# EAGLE design BM_v2 (EAGLE 7.6.0)

## Sheet 1 of 4: Microcontroller
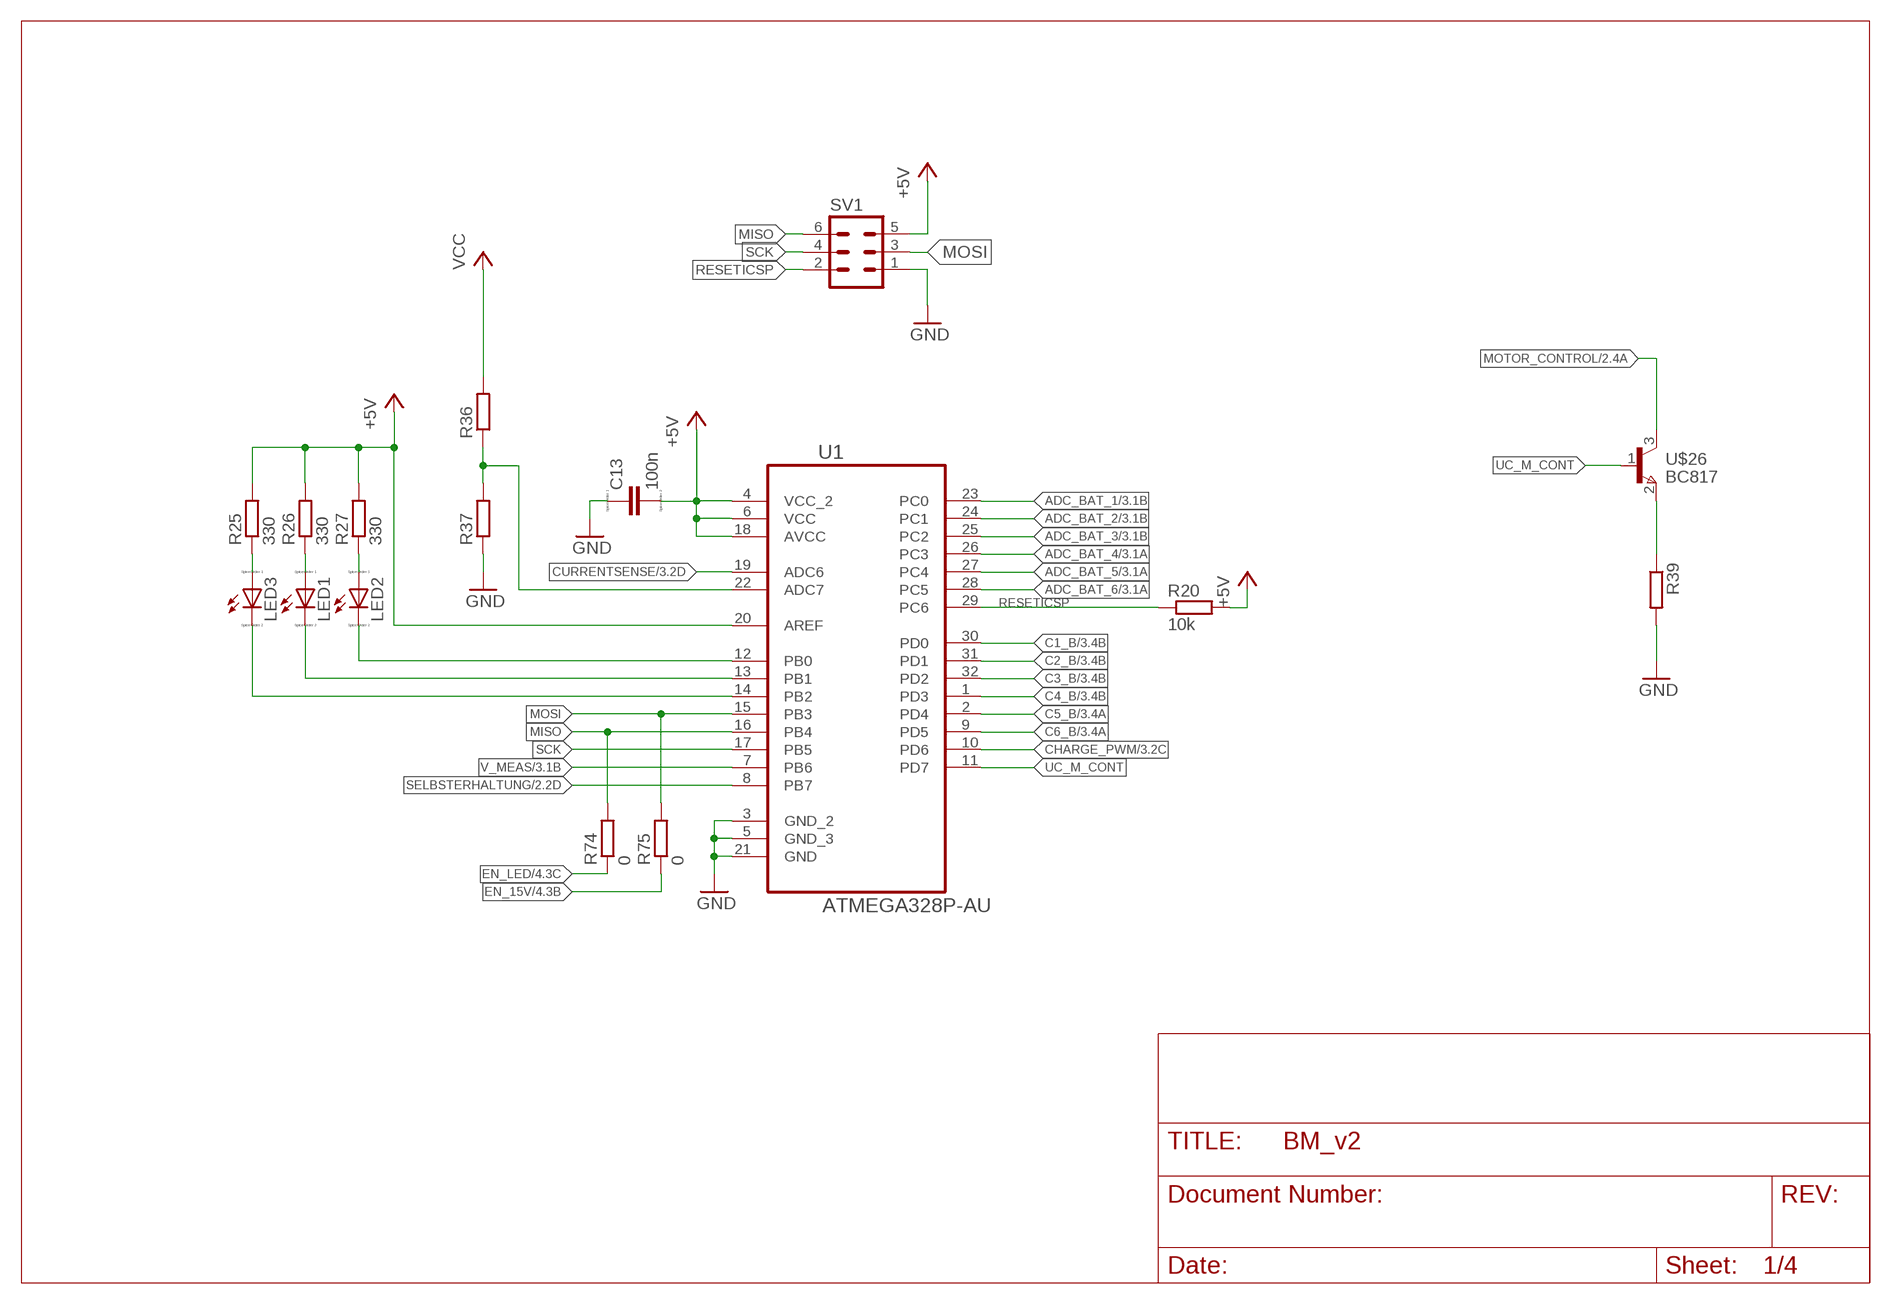
[diagram p0: schematic, sheet 1]

### Parts
C13  100n  CC0603  [C0603]
LED1  LED_E  [LED_1206]
LED2  LED_E  [LED_1206]
LED3  LED_E  [LED_1206]
R20  10k  R-EU_R0603  [R0603]
R25  330  R-EU_R0603  [R0603]
R26  330  R-EU_R0603  [R0603]
R27  330  R-EU_R0603  [R0603]
R36  R-EU_R0603  [R0603]
R37  R-EU_R0603  [R0603]
R39  R-EU_R0603  [R0603]
R74  0  R-EU_R0603  [R0603]
R75  0  R-EU_R0603  [R0603]
SV1  MA03-2  [MA03-2]
U1  ATMEGA328P-AU  [QFP80P900X900X120-32N]
U$26  BC817  [SOT23]

### Nets
+5V: C13.2 R20.2 R25.2 R26.2 R27.2 SV1.5 U1.4(VCC_2) U1.6(VCC) U1.18(AVCC) U1.20(AREF) ; also sheet 2,3
ADC_BAT_1: U1.23(PC0) ; also sheet 3
ADC_BAT_2: U1.24(PC1) ; also sheet 3
ADC_BAT_3: U1.25(PC2) ; also sheet 3
ADC_BAT_4: U1.26(PC3) ; also sheet 3
ADC_BAT_5: U1.27(PC4) ; also sheet 3
ADC_BAT_6: U1.28(PC5) ; also sheet 3
C1_B: U1.30(PD0) ; also sheet 3
C2_B: U1.31(PD1) ; also sheet 3
C3_B: U1.32(PD2) ; also sheet 3
C4_B: U1.1(PD3) ; also sheet 3
C5_B: U1.2(PD4) ; also sheet 3
C6_B: U1.9(PD5) ; also sheet 3
CHARGE_PWM: U1.10(PD6) ; also sheet 3
CURRENTSENSE: U1.19(ADC6) ; also sheet 3
EN_15V: R75.1 ; also sheet 4
EN_LED: R74.1 ; also sheet 4
GND [GND]: C13.1 R37.1 R39.2 SV1.1 U1.3(GND_2) U1.5(GND_3) U1.21(GND) ; also sheet 2,3,4
MISO: R74.2 SV1.6 U1.16(PB4)
MOSI: R75.2 SV1.3 U1.15(PB3)
MOTOR_CONTROL: U$26.3(C) ; also sheet 2
N$17: LED2.C U1.12(PB0)
N$18: LED1.C U1.13(PB1)
N$19: LED3.C U1.14(PB2)
N$23: LED2.A R27.1
N$24: LED1.A R26.1
N$25: LED3.A R25.1
N$26: R39.1 U$26.2(E)
N$27: R36.1 R37.2 U1.22(ADC7)
RESETICSP: R20.1 SV1.2 U1.29(PC6)
SCK: SV1.4 U1.17(PB5)
SELBSTERHALTUNG: U1.8(PB7) ; also sheet 2
UC_M_CONT: U1.11(PD7) U$26.1(B)
V_MEAS: U1.7(PB6) ; also sheet 3
VCC: R36.2 ; also sheet 2

## Sheet 2 of 4: Power Management
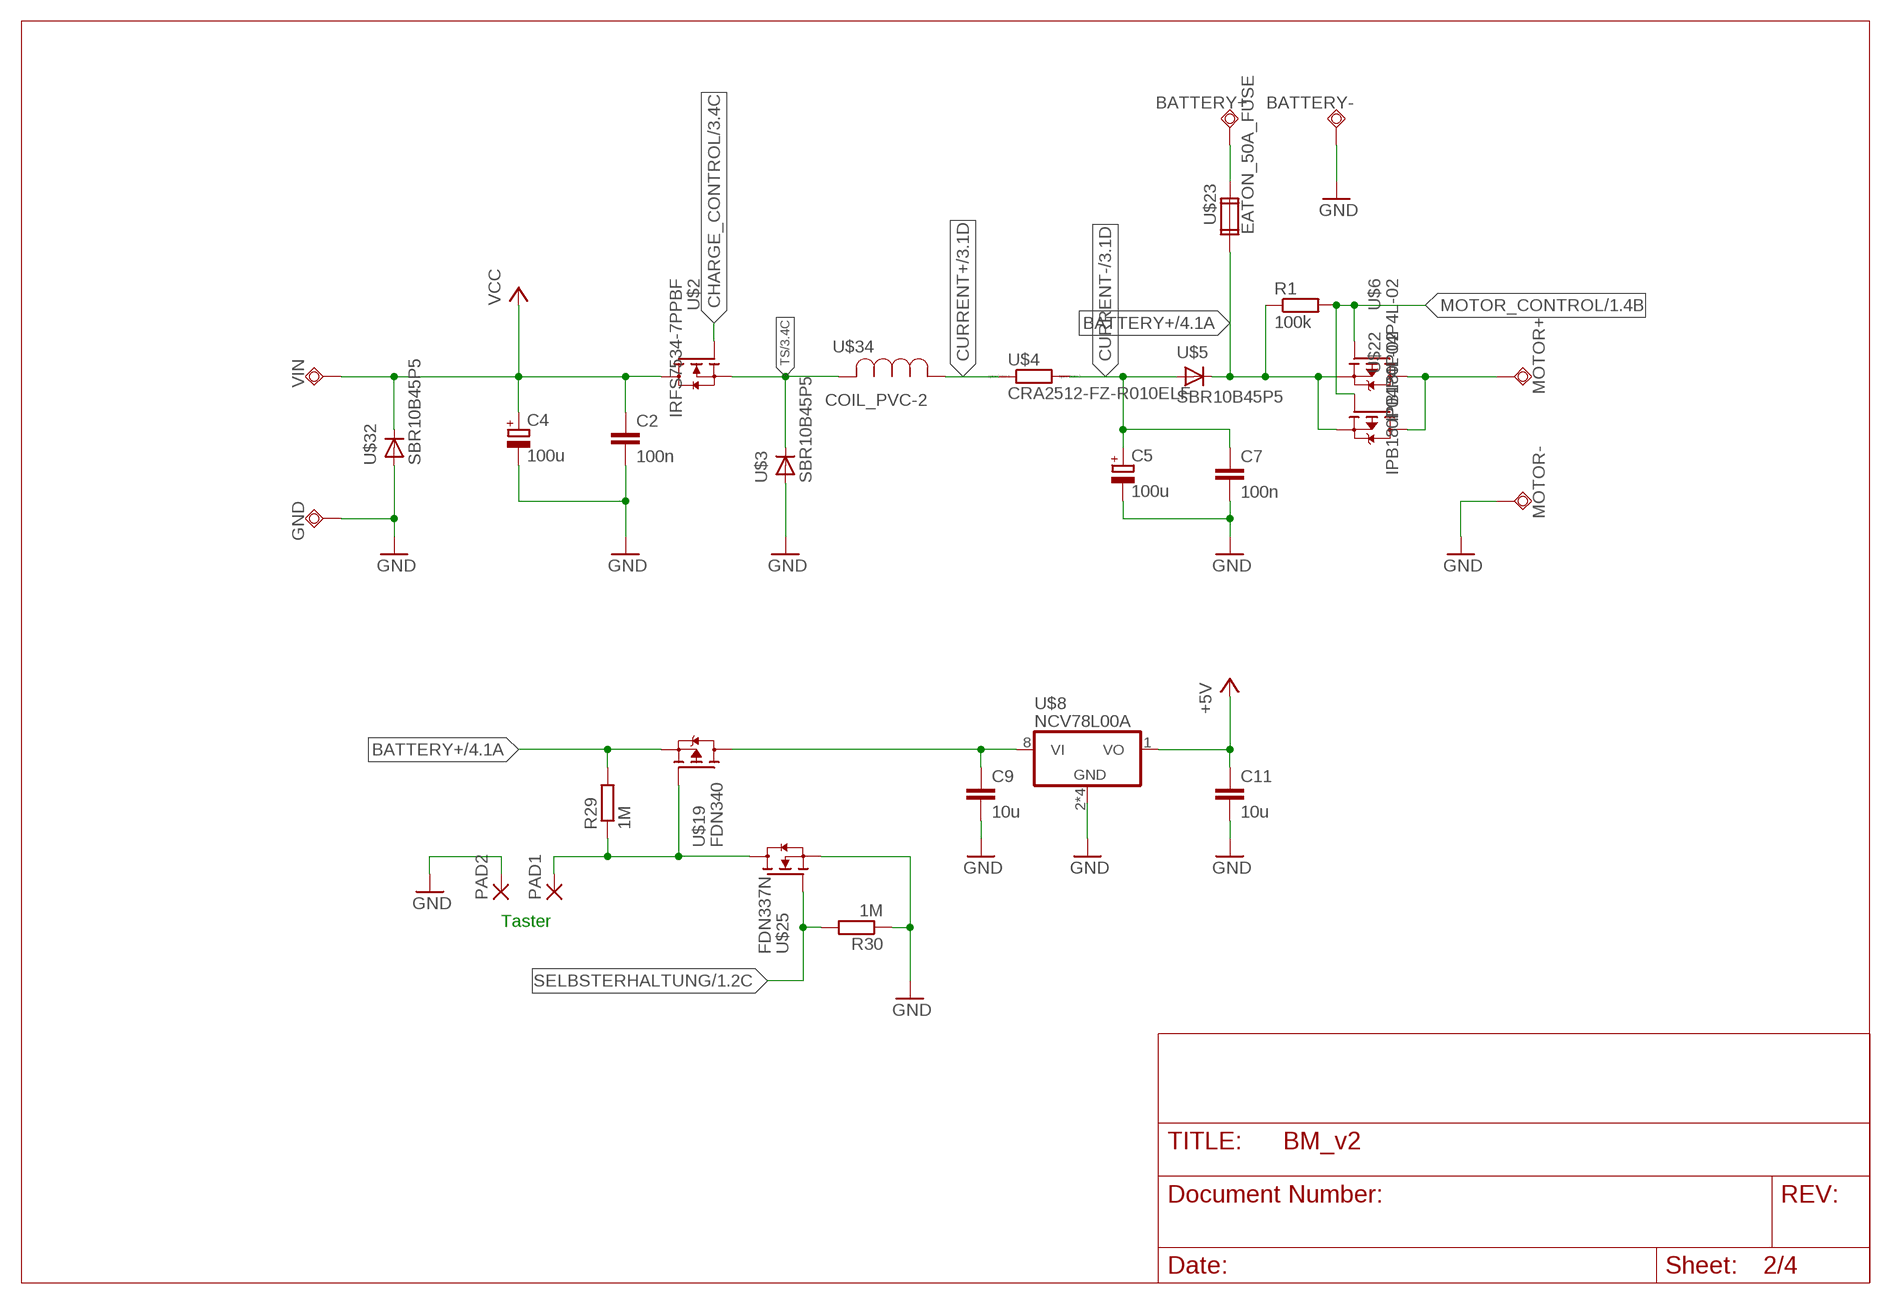
[diagram p1: schematic, sheet 2]

### Parts
BATTERY+  Battery+  PAD  [TESTPAD]
BATTERY-  Battery+  PAD  [TESTPAD]
C2  100n  C-EUC0603  [C0603]
C4  100u  CPOL-EUE3.5-10  [E3,5-10]
C5  100u  CPOL-EUE3.5-10  [E3,5-10]
C7  100n  C-EUC0603  [C0603]
C9  10u  C-EUC0805  [C0805]
C11  10u  C-EUC0805  [C0805]
GND  Battery+  PAD  [TESTPAD]
MOTOR+  Battery+  PAD  [TESTPAD]
MOTOR-  PAD  [TESTPAD]
PAD1  SMD5  [SMD2,54-5,08]
PAD2  SMD5  [SMD2,54-5,08]
R1  100k  R-EU_R0603  [R0603]
R29  1M  R-EU_R0603  [R0603]
R30  1M  R-EU_R0603  [R0603]
U$2  IRFS7534-7PPBF  [PG-TO263-7-3]
U$3  SBR10B45P5  [POWERDI-5]
U$4  CRA2512-FZ-R010ELF  [R2512]
U$5  SBR10B45P5  [POWERDI-5]
U$6  IPB180P04P4L-02  [PG-TO263-7-3]
U$8  NCV78L00A  [SOIC8]
U$19  FDN340  [SOT23]
U$22  IPB180P04P4L-02  [PG-TO263-7-3]
U$23  EATON_50A_FUSE  [LITTELFUSE]
U$25  FDN337N  [SOT23]
U$32  SBR10B45P5  [POWERDI-5]
U$34  COIL_PVC-2  [COIL_PVC-2]
VIN  Battery+  PAD  [TESTPAD]

### Nets
+5V: C11.1 U$8.1(VO) ; also sheet 1,3
BATTERY+: R1.1 R29.2 U$5.PAD(C) U$6.2(S) U$6.3(S) U$6.5(S) U$6.6(S) U$6.7(S) U$19.2(S) U$22.2(S) U$22.3(S) U$22.5(S) U$22.6(S) U$22.7(S) U$23.P$1(1A) ; also sheet 4
CHARGE_CONTROL: U$2.1(G) ; also sheet 3
CURRENT+: U$4.1 U$34.P$1 ; also sheet 3
CURRENT-: C5.+ C7.1 U$4.2 U$5.L(A) U$5.R(A) ; also sheet 3
GND [GND]: BATTERY-.P$1(TP) C2.2 C4.- C5.- C7.2 C9.2 C11.2 GND.P$1(TP) MOTOR-.P$1(TP) PAD2.1(P) R30.1 U$3.L(A) U$3.R(A) U$8.2(GND) U$8.3(GND) U$8.6(GND) U$8.7(GND) U$25.2(S) U$32.L(A) U$32.R(A) ; also sheet 1,3,4
MOTOR+: MOTOR+.P$1(TP) U$6.8(D) U$22.8(D)
MOTOR_CONTROL: R1.2 U$6.1(G) U$22.1(G) ; also sheet 1
N$20: PAD1.1(P) R29.1 U$19.1(G) U$25.3(D)
N$73: BATTERY+.P$1(TP) U$23.P$3(2A)
SELBSTERHALTUNG: R30.2 U$25.1(G) ; also sheet 1
TEST: C9.1 U$8.8(VI) U$19.3(D)
TS: U$2.2(S) U$2.3(S) U$2.5(S) U$2.6(S) U$2.7(S) U$3.PAD(C) U$34.P$2 ; also sheet 3
VCC: C2.1 C4.+ U$2.8(D) U$32.PAD(C) VIN.P$1(TP) ; also sheet 1

### Notes on the sheet
- Taster

## Sheet 3 of 4: Battery Balancing and charging Addition
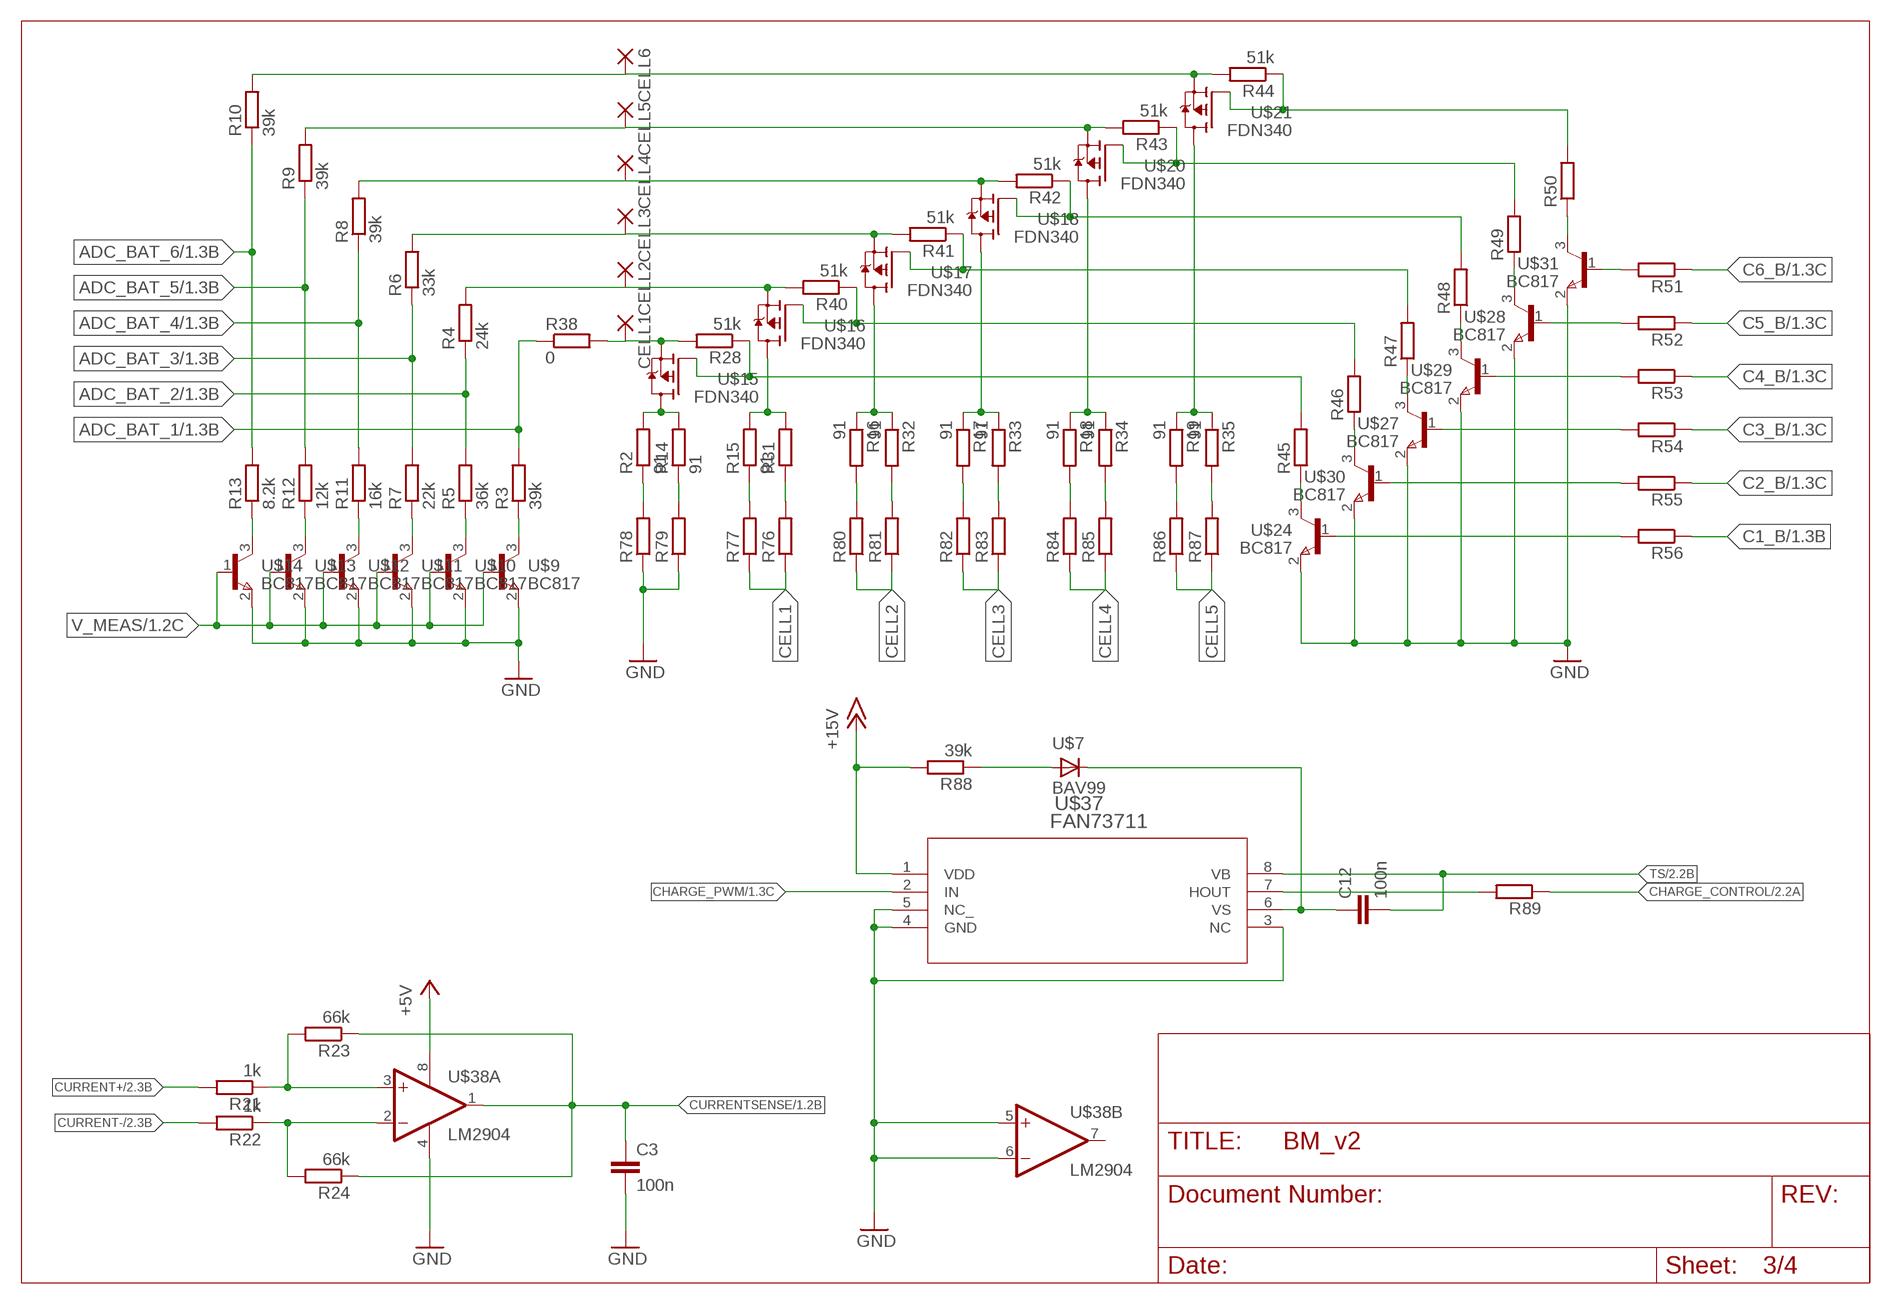
[diagram p2: schematic, sheet 3]

### Parts
C3  100n  C-EUC0603  [C0603]
C12  100n  C-EUC0603  [C0603]
CELL1  SMD5  [SMD2,54-5,08]
CELL2  SMD5  [SMD2,54-5,08]
CELL3  SMD5  [SMD2,54-5,08]
CELL4  SMD5  [SMD2,54-5,08]
CELL5  SMD5  [SMD2,54-5,08]
CELL6  SMD5  [SMD2,54-5,08]
R2  91  R-EU_R0603  [R0603]
R3  39k  R-EU_R0603  [R0603]
R4  24k  R-EU_R0603  [R0603]
R5  36k  R-EU_R0603  [R0603]
R6  33k  R-EU_R0603  [R0603]
R7  22k  R-EU_R0603  [R0603]
R8  39k  R-EU_R0603  [R0603]
R9  39k  R-EU_R0603  [R0603]
R10  39k  R-EU_R0603  [R0603]
R11  16k  R-EU_R0603  [R0603]
R12  12k  R-EU_R0603  [R0603]
R13  8.2k  R-EU_R0603  [R0603]
R14  91  R-EU_R0603  [R0603]
R15  91  R-EU_R0603  [R0603]
R16  91  R-EU_R0603  [R0603]
R17  91  R-EU_R0603  [R0603]
R18  91  R-EU_R0603  [R0603]
R19  91  R-EU_R0603  [R0603]
R21  1k  R-EU_R0603  [R0603]
R22  1k  R-EU_R0603  [R0603]
R23  66k  R-EU_R0603  [R0603]
R24  66k  R-EU_R0603  [R0603]
R28  51k  R-EU_R0603  [R0603]
R31  R-EU_R0603  [R0603]
R32  91  R-EU_R0603  [R0603]
R33  91  R-EU_R0603  [R0603]
R34  91  R-EU_R0603  [R0603]
R35  91  R-EU_R0603  [R0603]
R38  0  R-EU_R0603  [R0603]
R40  51k  R-EU_R0603  [R0603]
R41  51k  R-EU_R0603  [R0603]
R42  51k  R-EU_R0603  [R0603]
R43  51k  R-EU_R0603  [R0603]
R44  51k  R-EU_R0603  [R0603]
R45  R-EU_R0603  [R0603]
R46  R-EU_R0603  [R0603]
R47  R-EU_R0603  [R0603]
R48  R-EU_R0603  [R0603]
R49  R-EU_R0603  [R0603]
R50  R-EU_R0603  [R0603]
R51  R-EU_R0603  [R0603]
R52  R-EU_R0603  [R0603]
R53  R-EU_R0603  [R0603]
R54  R-EU_R0603  [R0603]
R55  R-EU_R0603  [R0603]
R56  R-EU_R0603  [R0603]
R76  R-EU_R0603  [R0603]
R77  R-EU_R0603  [R0603]
R78  R-EU_R0603  [R0603]
R79  R-EU_R0603  [R0603]
R80  R-EU_R0603  [R0603]
R81  R-EU_R0603  [R0603]
R82  R-EU_R0603  [R0603]
R83  R-EU_R0603  [R0603]
R84  R-EU_R0603  [R0603]
R85  R-EU_R0603  [R0603]
R86  R-EU_R0603  [R0603]
R87  R-EU_R0603  [R0603]
R88  39k  R-EU_R0603  [R0603]
R89  R-EU_R0603  [R0603]
U$7  BAV99  [SOT23]
U$9  BC817  [SOT23]
U$10  BC817  [SOT23]
U$11  BC817  [SOT23]
U$12  BC817  [SOT23]
U$13  BC817  [SOT23]
U$14  BC817  [SOT23]
U$15  FDN340  [SOT23]
U$16  FDN340  [SOT23]
U$17  FDN340  [SOT23]
U$18  FDN340  [SOT23]
U$20  FDN340  [SOT23]
U$21  FDN340  [SOT23]
U$24  BC817  [SOT23]
U$27  BC817  [SOT23]
U$28  BC817  [SOT23]
U$29  BC817  [SOT23]
U$30  BC817  [SOT23]
U$31  BC817  [SOT23]
U$37  FAN73711  [SOIC8]
U$38  LM2904  [SOIC8]

### Nets
+5V: U$38.8(A:V+) ; also sheet 1,2
+15V: R88.2 U$37.1(VDD) ; also sheet 4
ADC_BAT_1: R3.2 R38.1 ; also sheet 1
ADC_BAT_2: R4.1 R5.2 ; also sheet 1
ADC_BAT_3: R6.1 R7.2 ; also sheet 1
ADC_BAT_4: R8.1 R11.2 ; also sheet 1
ADC_BAT_5: R9.1 R12.2 ; also sheet 1
ADC_BAT_6: R10.1 R13.2 ; also sheet 1
C1_B: R56.1 ; also sheet 1
C2_B: R55.1 ; also sheet 1
C3_B: R54.1 ; also sheet 1
C4_B: R53.1 ; also sheet 1
C5_B: R52.1 ; also sheet 1
C6_B: R51.1 ; also sheet 1
CELL1: CELL1.1(P) R28.2 R38.2 R76.1 R77.1 U$15.2(S)
CELL2: CELL2.1(P) R4.2 R40.2 R80.1 R81.1 U$16.2(S)
CELL3: CELL3.1(P) R6.2 R41.2 R82.1 R83.1 U$17.2(S)
CELL4: CELL4.1(P) R8.2 R42.2 R84.1 R85.1 U$18.2(S)
CELL5: CELL5.1(P) R9.2 R43.2 R86.1 R87.1 U$20.2(S)
CELL6: CELL6.1(P) R10.2 R44.2 U$21.2(S)
CHARGE_CONTROL: R89.1 ; also sheet 2
CHARGE_PWM: U$37.2(IN) ; also sheet 1
CURRENT+: R21.2 ; also sheet 2
CURRENT-: R22.2 ; also sheet 2
CURRENTSENSE: C3.1 R23.1 R24.1 U$38.1(A:OUT) ; also sheet 1
GND [GND]: C3.2 R78.1 R79.1 U$9.2(E) U$10.2(E) U$11.2(E) U$12.2(E) U$13.2(E) U$14.2(E) U$24.2(E) U$27.2(E) U$28.2(E) U$29.2(E) U$30.2(E) U$31.2(E) U$37.3(NC) U$37.4(GND) U$37.5(NC_) U$38.4(A:V-) U$38.5(B:+IN) U$38.6(B:-IN) ; also sheet 1,2,4
N$2: C12.1 U$7.2(C) U$37.6(VS)
N$3: R13.1 U$14.3(C)
N$4: R12.1 U$13.3(C)
N$5: R2.2 R14.2 U$15.3(D)
N$6: R15.2 R31.2 U$16.3(D)
N$7: R11.1 U$12.3(C)
N$8: R7.1 U$11.3(C)
N$9: R5.1 U$10.3(C)
N$10: R3.1 U$9.3(C)
N$11: R16.1 R32.1 U$17.3(D)
N$12: R17.1 R33.1 U$18.3(D)
N$13: R18.1 R34.1 U$20.3(D)
N$14: R19.1 R35.1 U$21.3(D)
N$15: R21.1 R23.2 U$38.3(A:+IN)
N$16: R22.1 R24.2 U$38.2(A:-IN)
N$22: R28.1 R45.2 U$15.1(G)
N$28: R40.1 R46.2 U$16.1(G)
N$29: R41.1 R47.2 U$17.1(G)
N$30: R42.1 R48.2 U$18.1(G)
N$31: R43.1 R49.2 U$20.1(G)
N$32: R44.1 R50.2 U$21.1(G)
N$33: R49.1 U$28.3(C)
N$34: R50.1 U$31.3(C)
N$35: R48.1 U$29.3(C)
N$36: R47.1 U$27.3(C)
N$37: R46.1 U$30.3(C)
N$38: R45.1 U$24.3(C)
N$39: R51.2 U$31.1(B)
N$40: R52.2 U$28.1(B)
N$41: R53.2 U$29.1(B)
N$42: R54.2 U$27.1(B)
N$43: R55.2 U$30.1(B)
N$44: R56.2 U$24.1(B)
N$58: R15.1 R77.2
N$59: R31.1 R76.2
N$60 [GND]: R2.1 R78.2
N$61 [GND]: R14.1 R79.2
N$62: R16.2 R80.2
N$63: R32.2 R81.2
N$64: R17.2 R82.2
N$65: R33.2 R83.2
N$66: R18.2 R84.2
N$67: R34.2 R85.2
N$68: R19.2 R86.2
N$69: R35.2 R87.2
N$70: R88.1 U$7.1(A)
N$71: R89.2 U$37.7(HOUT)
TS: C12.2 U$37.8(VB) ; also sheet 2
V_MEAS: U$9.1(B) U$10.1(B) U$11.1(B) U$12.1(B) U$13.1(B) U$14.1(B) ; also sheet 1
Unconnected: U$38.7(B:OUT)

## Sheet 4 of 4: Power Source and LED
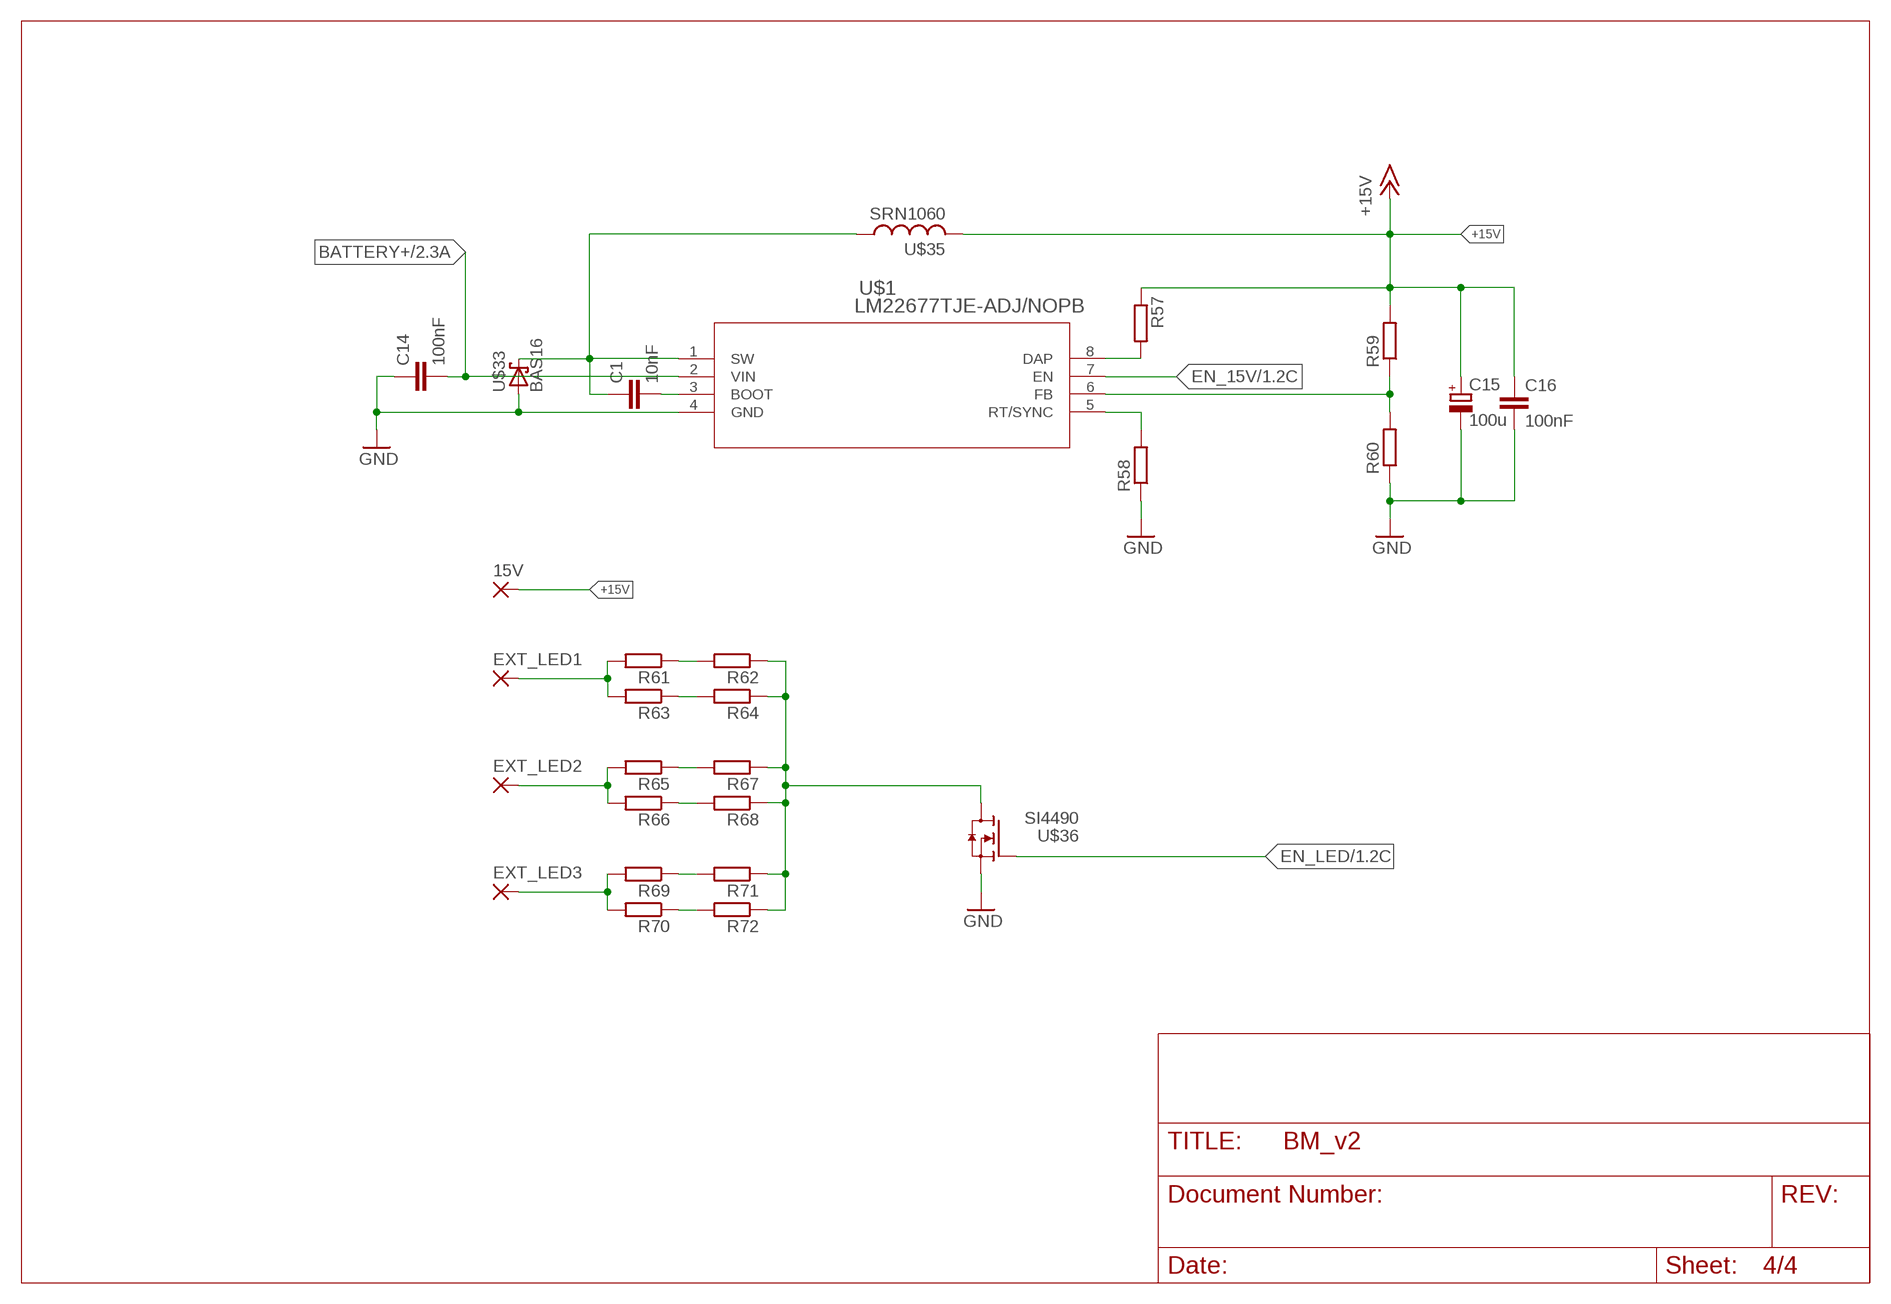
[diagram p3: schematic, sheet 4]

### Parts
15V  SMD5  [SMD2,54-5,08]
C1  10nF  C-EUC0603  [C0603]
C14  100nF  C-EUC0603  [C0603]
C15  100u  CPOL-EUE3.5-10  [E3,5-10]
C16  100nF  C-EUC0603  [C0603]
EXT_LED1  SMD5  [SMD2,54-5,08]
EXT_LED2  SMD5  [SMD2,54-5,08]
EXT_LED3  SMD5  [SMD2,54-5,08]
R57  R-EU_R0603  [R0603]
R58  R-EU_R0603  [R0603]
R59  R-EU_R0603  [R0603]
R60  R-EU_R0603  [R0603]
R61  R-EU_R0603  [R0603]
R62  R-EU_R0603  [R0603]
R63  R-EU_R0603  [R0603]
R64  R-EU_R0603  [R0603]
R65  R-EU_R0603  [R0603]
R66  R-EU_R0603  [R0603]
R67  R-EU_R0603  [R0603]
R68  R-EU_R0603  [R0603]
R69  R-EU_R0603  [R0603]
R70  R-EU_R0603  [R0603]
R71  R-EU_R0603  [R0603]
R72  R-EU_R0603  [R0603]
U$1  LM22677TJE-ADJ/NOPB  [TJ7A]
U$33  BAS16  [SOT23]
U$35  SRN1060  [SRN1060]
U$36  SI4490  [SOIC8]

### Nets
+15V: 15V.1(P) C15.+ C16.1 R57.1 R59.2 U$35.P$2 ; also sheet 3
BATTERY+: C14.2 U$1.2(VIN) ; also sheet 2
EN_15V: U$1.7(EN) ; also sheet 1
EN_LED: U$36.4(G) ; also sheet 1
FEEDBACK: R59.1 R60.2 U$1.6(FB)
GND [GND]: C14.1 C15.- C16.2 R58.1 R60.1 U$1.4(GND) U$33.1(A) U$36.1(S) U$36.2(S) U$36.3(S) ; also sheet 1,2,3
N$1: C1.2 U$1.3(BOOT)
N$21: C1.1 U$1.1(SW) U$33.3(C) U$35.P$1
N$45: R57.2 U$1.8(DAP)
N$46: R58.2 U$1.5(RT/SYNC)
N$47: EXT_LED1.1(P) R61.2 R63.2
N$48: R61.1 R62.2
N$49: R63.1 R64.2
N$50: EXT_LED2.1(P) R65.2 R66.2
N$51: R65.1 R67.2
N$52: R66.1 R68.2
N$53: R62.1 R64.1 R67.1 R68.1 R71.1 R72.1 U$36.5(D) U$36.6(D) U$36.7(D) U$36.8(D)
N$54: EXT_LED3.1(P) R69.2 R70.2
N$55: R69.1 R71.2
N$56: R70.1 R72.2

## Library data of the parts
15V CELL1-CELL6 EXT_LED1-EXT_LED3 PAD1 PAD2 = wirepad:SMD5: SMD PAD
BATTERY+ BATTERY- GND MOTOR+ MOTOR- VIN = BM_pre:PAD
C1-C3 C7 C9 C11 C12 C14 C16 = rcl:C-EU: CAPACITOR, European symbol
C4 C5 C15 = rcl:CPOL-EU: POLARIZED CAPACITOR, European symbol
C13 = eagle-ltspice:C: CAPACITOR, European symbol; SPICEMODEL: NONE; SPICEPREFIX: C
LED1-LED3 = eagle-ltspice:LED_E: LED Source: http://www.osram.convergy.de Source: www.luxeon.com Source: www.kingbright.com; SPICEMODEL: NONE; SPICEPREFIX: D; SPICETYPE: diode
R1-R72 R74-R89 = rcl:R-EU_: RESISTOR, European symbol
SV1 = con-lstb:MA03-2: PIN HEADER; OC_FARNELL: unknown; OC_NEWARK: unknown
U1 = Atmel_By_element14_Batch_1-00:ATMEGA328P-AU: 8-bit Microcontroller with In-System Programmable Flash; MPN: ATMEGA328P-AU; OC_FARNELL: 1715486; OC_NEWARK: 14R4631; PACKAGE: TQFP-32; SUPPLIER: Atmel
U$1 = BM_pre:LM22677TJE-ADJ/NOPB; MANUFACTURER_PART_NUMBER: lm22677tjeadjnopb; VENDOR: National Semiconductor
U$2 = BM_pre:IRFS7534-7PPBF
U$3 U$5 U$32 = BM_pre:SBR10B45P5
U$4 = BM_pre:CRA2512-FZ-R010ELF
U$6 U$22 = BM_pre:IPB180P04P4L-02
U$7 = BM_pre:BAV99
U$8 = BM_pre:NCV78L00A
U$9-U$14 U$24 U$26-U$31 = BM_pre:BC817
U$15-U$21 = BM_pre:FDN340
U$23 = BM_pre:EATON_50A_FUSE
U$25 = BM_pre:FDN337N
U$33 = BM_pre:BAS16
U$34 = BM_pre:COIL_PVC-2
U$35 = BM_pre:SRN1060
U$36 = BM_pre:SI4490
U$37 = BM_pre:FAN73711
U$38 = BM_pre:LM2904

## Board
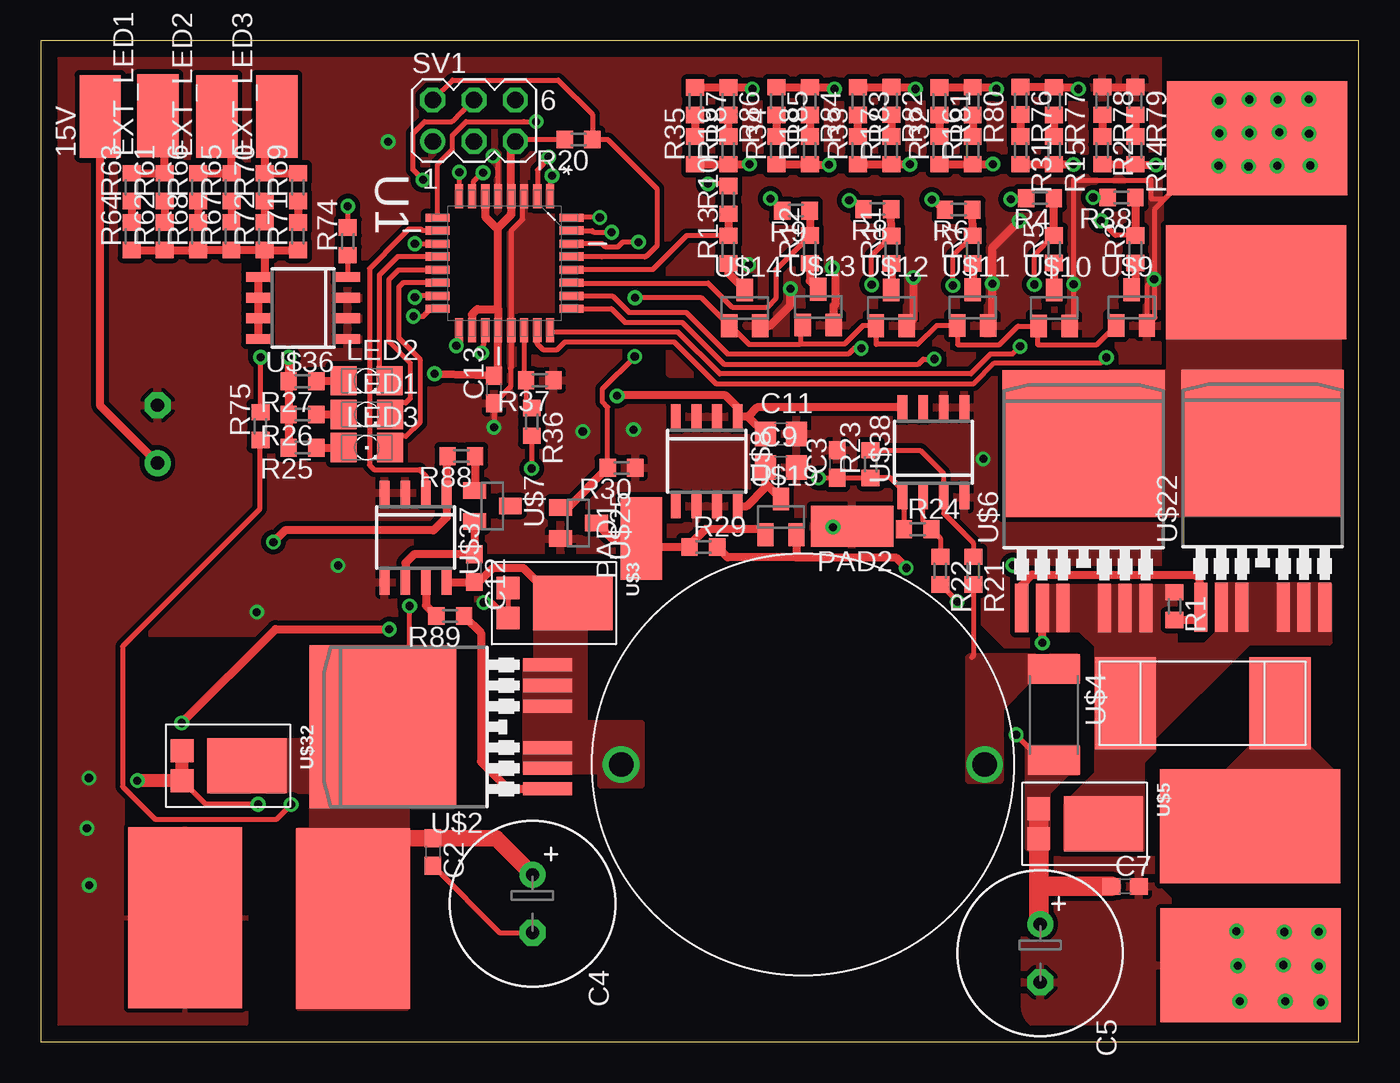
[diagram p4: board, top side]
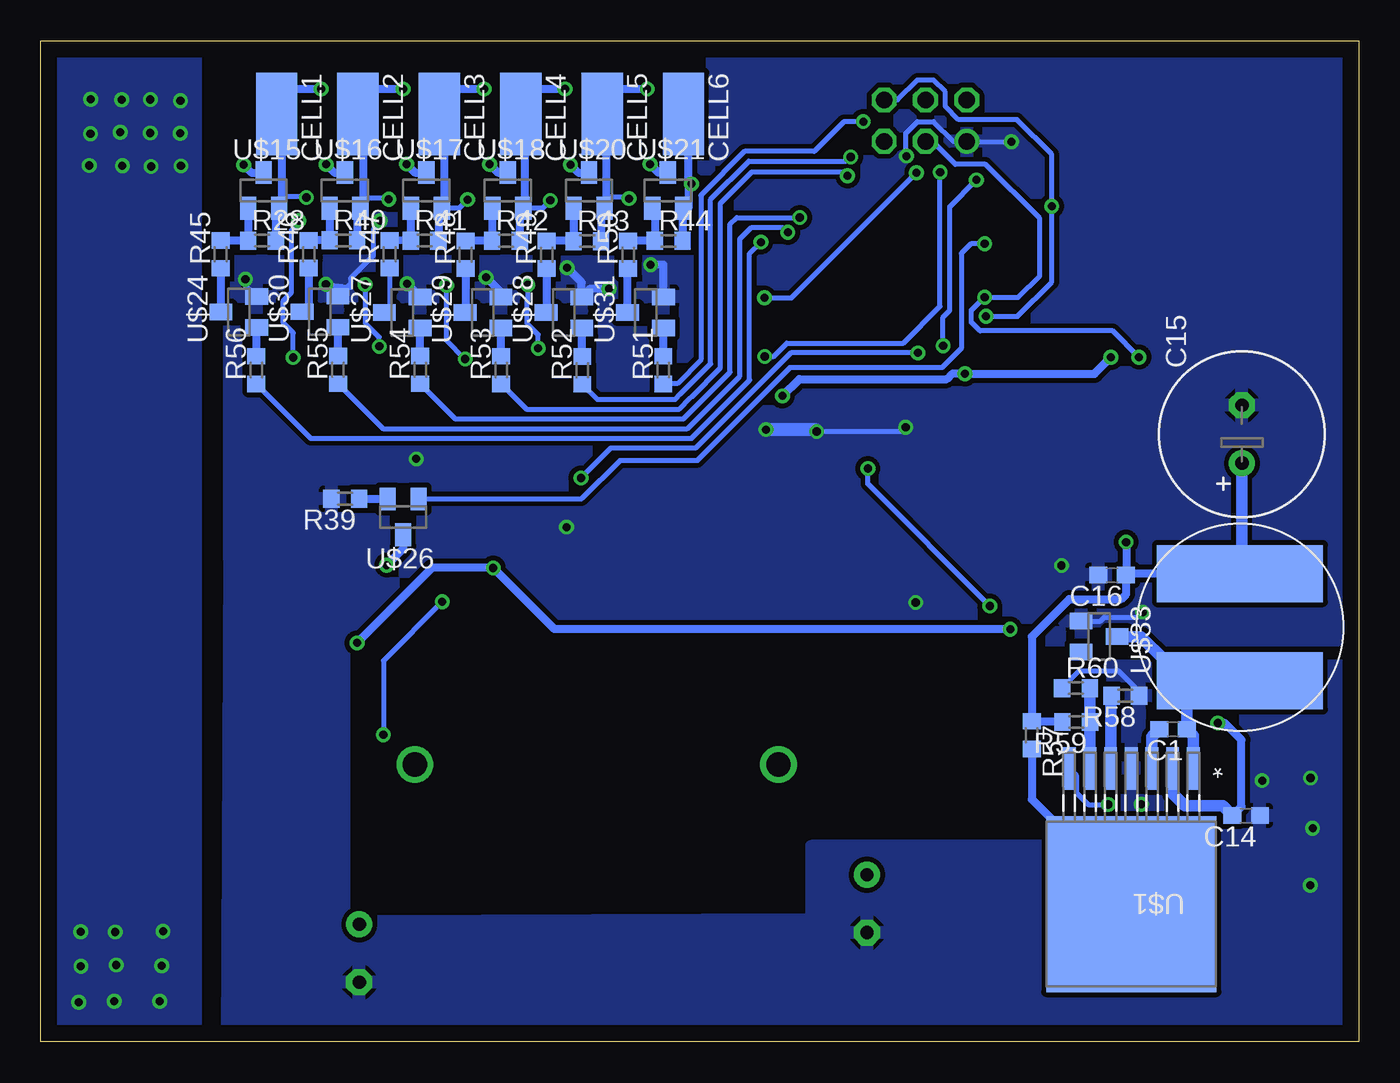
[diagram p5: board, bottom side, seen from below]

Size 81 x 61.5 mm. Coordinates in mm from the lower left corner, seen from the top.
Outline: 0,0 81,0 81,61.5 0,61.5 0,0
Copper layers (1*16): Top 0.035mm / dielectric 1.5mm / Bottom 0.035mm
Design rules "default *": minimum track width 0.3mm, minimum drill 0.5mm, track to track 0.3mm, track to pad 0.3mm, pad to pad 10mil, via to via 10mil, smd to smd 8mil, copper to edge 40mil, drill to drill 8mil, minimum pad ring 10mil, minimum via ring 8mil, stop-mask expansion 4mil, vias tented up to drill 0mil, thermal gap 10mil

### Footprints (pad centres in the part's own frame; a part is rotated, then mirrored left to right if it is on the bottom)
SMD2,54-5,08 = smd 2.54 x 5.08: 1 0,0
TESTPAD = smd 11.1 x 7: P$1 0,0
C0603 = smd 1.1 x 1: 1 -0.85,0; 2 0.85,0
E3,5-10 = drill 0.813 pad 1.6: + -1.778,0 | drill 0.813 pad 1.6 octagon: - 1.778,0
C0805 = smd 1.3 x 1.5: 1 -0.95,0; 2 0.95,0
LED_1206 = smd 1.6 x 1.803: A -1.422,0; C 1.422,0
R0603 = smd 1 x 1.1: 1 -0.85,0; 2 0.85,0
MA03-2 = drill 1.016: 1 -2.54,-1.27 | drill 1.016 octagon: 2 -2.54,1.27; 3 0,-1.27; 4 0,1.27; 5 2.54,-1.27; 6 2.54,1.27
QFP80P900X900X120-32N = smd 1.473 x 0.508: 1 -4.115,2.794; 2 -4.115,2.007; 3 -4.115,1.194; 4 -4.115,0.406; 5 -4.115,-0.406; 6 -4.115,-1.194; 7 -4.115,-2.007; 8 -4.115,-2.794; 17 4.115,-2.794; 18 4.115,-2.007; 19 4.115,-1.194; 20 4.115,-0.406; 21 4.115,0.406; 22 4.115,1.194; 23 4.115,2.007; 24 4.115,2.794 | smd 0.508 x 1.473: 9 -2.794,-4.115; 10 -2.007,-4.115; 11 -1.194,-4.115; 12 -0.406,-4.115; 13 0.406,-4.115; 14 1.194,-4.115; 15 2.007,-4.115; 16 2.794,-4.115; 25 2.794,4.115; 26 2.007,4.115; 27 1.194,4.115; 28 0.406,4.115; 29 -0.406,4.115; 30 -1.194,4.115; 31 -2.007,4.115; 32 -2.794,4.115
TJ7A = smd 0.787 x 2.616: 1 -3.81,-8.344; 2 -2.54,-8.344; 3 -1.27,-8.344; 4 0,-8.344; 5 1.27,-8.344; 6 2.54,-8.344; 7 3.81,-8.344 | smd 10.465 x 10.82: 8 0,0
PG-TO263-7-3 = smd 0.8 x 3: 1 -3.81,-9.207; 2 -2.54,-9.207; 3 -1.27,-9.207; 5 1.27,-9.207; 6 2.54,-9.207; 7 3.81,-9.207 | smd 10 x 9: 8 0,0.895
POWERDI-5 = smd 1.39 x 1.4: L -0.92,-1.552; R 0.92,-1.552 | smd 3.36 x 4.86: PAD 0,2.43
R2512 = smd 1.8 x 3.2: 1 -2.8,0; 2 2.8,0
SOT23 = smd 1 x 1.4: 1 -0.95,-1.1; 2 0.95,-1.1; 3 0,1.1
SOIC8 = smd 0.6 x 1.5: 1 -1.905,-2.75; 2 -0.635,-2.75; 3 0.635,-2.75; 4 1.905,-2.75; 5 1.905,2.75; 6 0.635,2.75; 7 -0.635,2.75; 8 -1.905,2.75
LITTELFUSE = smd 3.775 x 5.65: P$1 4.747,0; P$3 -4.747,0
COIL_PVC-2 = drill 1.5: P$1 11.175,0; P$2 -11.175,0
SRN1060 = smd 3.5 x 10.2: P$1 -3.3,0; P$2 3.3,0

### Placement (x,y rotation side)
15V  3.66,56.85 0 top
BATTERY+  74.31,13.24 0 top
BATTERY-  74.34,4.71 0 top
C1  11.41,19.2 180 bottom
C2  24.1,11.66 270 top
C3  48.94,35.49 90 top
C4  30.22,8.49 270 top
C5  61.42,5.44 270 top
C7  66.64,9.55 0 top
C9  45.49,35.29 0 top
C11  45.49,37.34 0 top
C12  26.64,29.1 270 top
C13  27.86,40.08 90 top
C14  6.92,13.9 180 bottom
C15  7.18,37.33 90 bottom
C16  15.16,28.68 180 bottom
CELL1  66.5,57 180 bottom
CELL2  61.5,57 180 bottom
CELL3  56.5,57 180 bottom
CELL4  51.5,57 180 bottom
CELL5  46.5,57 180 bottom
CELL6  41.5,57 180 bottom
EXT_LED1  7.2,56.89 0 top
EXT_LED2  10.82,56.84 0 top
EXT_LED3  14.51,56.85 0 top
GND  74.74,55.52 0 top
LED1  20.04,38.54 0 top
LED2  20.03,40.61 0 top
LED3  20.04,36.5 0 top
MOTOR+  74.68,46.65 0 top
MOTOR-  8.89,7.62 90 top
PAD1  36.9,30.93 0 top
PAD2  49.86,31.67 90 top
R1  69.67,26.77 270 top
R2  65.23,54.76 270 top
R3  67.27,48.69 90 top
R4  61.41,51.83 180 top
R5  62.27,48.69 90 top
R6  56.41,51.12 180 top
R7  57.27,48.67 90 top
R8  51.41,51.15 180 top
R9  46.41,51.06 180 top
R10  42.26,51.72 90 top
R11  52.27,48.66 90 top
R12  47.26,48.68 90 top
R13  42.26,48.67 90 top
R14  67.27,54.76 270 top
R15  62.27,54.76 270 top
R16  57.27,54.76 90 top
R17  52.27,54.76 90 top
R18  47.26,54.76 90 top
R19  42.26,54.76 90 top
R20  33.05,55.43 180 top
R21  57.31,28.95 270 top
R22  55.28,28.95 270 top
R23  51,35.49 90 top
R24  53.89,31.49 0 top
R25  16.09,36.5 180 top
R26  16.09,38.54 180 top
R27  16.09,40.58 180 top
R28  67.4,49.22 0 bottom
R29  40.72,30.4 0 top
R30  35.69,35.26 180 top
R31  60.21,54.76 270 top
R32  55.23,54.76 90 top
R33  50.23,54.76 90 top
R34  45.22,54.76 90 top
R35  40.22,54.76 90 top
R36  30.18,38.08 270 top
R37  30.67,40.64 180 top
R38  66.42,51.87 180 top
R39  62.28,33.36 180 bottom
R40  62.4,49.23 0 bottom
R41  57.41,49.22 0 bottom
R42  52.41,49.21 0 bottom
R43  47.41,49.19 0 bottom
R44  42.41,49.2 0 bottom
R45  69.94,48.37 90 bottom
R46  64.53,48.38 90 bottom
R47  59.56,48.38 90 bottom
R48  54.89,48.35 90 bottom
R49  49.91,48.35 90 bottom
R50  44.9,48.35 90 bottom
R51  42.74,41.27 90 bottom
R52  47.72,41.25 90 bottom
R53  52.7,41.27 90 bottom
R54  57.68,41.28 90 bottom
R55  62.73,41.28 90 bottom
R56  67.75,41.27 90 bottom
R57  20.1,18.84 270 bottom
R58  14.35,21.26 180 bottom
R59  17.37,19.65 180 bottom
R60  17.38,21.73 0 bottom
R61  7.63,52.51 90 top
R62  7.63,49.49 90 top
R63  5.59,52.51 90 top
R64  5.59,49.49 90 top
R65  11.73,52.51 90 top
R66  9.68,52.51 90 top
R67  11.72,49.5 90 top
R68  9.68,49.49 90 top
R69  15.81,52.51 90 top
R70  13.77,52.51 90 top
R71  15.81,49.49 90 top
R72  13.77,49.5 90 top
R74  18.87,49.17 90 top
R75  13.51,37.82 90 top
R76  60.21,57.81 270 top
R77  62.27,57.79 270 top
R78  65.23,57.8 270 top
R79  67.27,57.8 270 top
R80  57.27,57.79 270 top
R81  55.23,57.78 270 top
R82  52.27,57.8 270 top
R83  50.23,57.79 270 top
R84  47.26,57.79 270 top
R85  45.22,57.79 270 top
R86  42.26,57.78 270 top
R87  40.22,57.78 270 top
R88  25.85,35.98 180 top
R89  25.17,26.16 180 top
SV1  26.63,56.59 0 top
U1  28.51,47.83 270 top
U$1  13.98,8.46 180 bottom
U$2  21.93,19.35 90 top
U$3  30.27,26.95 270 top
U$4  62.27,20.1 270 top
U$5  62.88,13.4 270 top
U$6  64.09,35.86 0 top
U$7  27.76,32.92 270 top
U$8  40.93,35.66 180 top
U$9  67.03,45.1 0 top
U$10  62.27,45.08 0 top
U$11  57.27,45.1 0 top
U$12  52.27,45.09 0 top
U$13  47.78,45.13 0 top
U$14  43.27,45.09 0 top
U$15  67.3,52.3 0 bottom
U$16  62.3,52.3 0 bottom
U$17  57.3,52.3 0 bottom
U$18  52.3,52.3 0 bottom
U$19  45.49,32.25 0 top
U$20  47.3,52.3 0 bottom
U$21  42.46,52.31 0 bottom
U$22  75.09,35.9 0 top
U$23  71.4,20.8 180 top
U$24  68.83,44.83 90 bottom
U$25  33.05,31.87 270 top
U$26  58.73,32.25 180 bottom
U$27  58.78,44.81 90 bottom
U$28  48.85,44.81 90 bottom
U$29  53.82,44.81 90 bottom
U$30  63.84,44.85 90 bottom
U$31  43.83,44.81 90 bottom
U$32  10.24,16.96 270 top
U$33  15.96,24.9 270 bottom
U$34  46.84,17.04 0 top
U$35  7.3,25.47 90 bottom
U$36  16.12,45.08 90 top
U$37  23.04,30.98 180 top
U$38  54.86,36.22 0 top
VIN  19.2,7.58 90 top

### Tracks (layer width: path | path; a pad name or v marks a point on that pad's centre or on a via)
+5V  (via drill 0.5)
  Top 0.3: R20.2 29.28,55.43 SV1.5
  Top 0.5: 43.47,38.41 U$8.1 42.84,38.97 42.09,39.71 35.45,39.71 v35.42,39.68 | 43.47,38.41 C11.1 | U$38.8 44.03,38.97 43.47,38.41 | U1.6 27.32,50.69 28.06,49.95 | 28.06,49.95 28.92,50.81 28.92,50.92 | 28.92,50.92 28.92,50.96 | 28.92,50.92 U1.4 28.92,55.32 SV1.5 | 28.1,45.07 U1.20 28.1,41.01 C13.2 24.25,41 v24.2,41.04 | 28.1,45.07 28.1,49.95 28.06,49.95 | U1.18 26.5,44.69 26.82,45.01 28.04,45.01 28.1,45.07 | v15.23,42.05 R27.2 R26.2 R25.2
  Bottom 0.5: v15.23,42.05 16.24,41.04 v24.2,41.04 25,41.04 25.32,40.72 34.38,40.72 v35.42,39.68
+15V  (via drill 0.5)
  Top 0.5: R88.2 24.95,35.92 U$37.1 24.95,32.23 24.14,31.42 15.02,31.42 v14.3,30.7 | C15.+ 3.66,39.07 15V.1
  Bottom 0.5: U$35.P$2 14.22,28.77 C16.1 | C16.1 14.3,27.5 14.6,27.2 17.8,27.2 20.1,24.9 R57.1 18.26,19.69 R59.2 | v14.3,30.7 C16.1
  Bottom 0.57: 7.18,28.89 U$35.P$2
  Bottom 0.7: C15.+ 7.18,28.89 U$35.P$2
ADC_BAT_1  (via drill 0.5)
  Top 0.3: U1.23 30.52,42.88 30.86,42.53 31.74,42.53 32.22,43 38.92,43 41.49,40.44 57.34,40.44 58.61,41.7 65.14,41.7 v65.48,42.04 | R3.2 66.04,49.54 v65.14,50.44
  Top 0.5: R38.1 R3.2
  Bottom 0.3: v65.14,50.44 65.14,50.3 65.59,49.86 65.59,46.04 66.09,45.54 66.09,44.16 65.48,43.55 v65.48,42.04
ADC_BAT_2  (via drill 0.5)
  Top 0.3: v60.19,42.72 59.73,42.26 58.38,42.26 57.17,41.04 41.74,41.04 39.17,43.6 31.42,43.6 U1.24 | v61.06,46.52 61.06,48.33 R5.2
  Top 0.5: R5.2 R4.1
  Bottom 0.3: v60.19,42.72 60.19,43.28 61.03,44.12 61.03,46.49 v61.06,46.52
ADC_BAT_3  (via drill 0.5)
  Top 0.3: v56.06,46.46 56.06,48.31 R7.2 | v54.91,41.94 54.24,41.94 53.93,41.64 41.98,41.64 39.42,44.2 35.9,44.2 35.07,45.04 U1.25
  Top 0.5: R7.2 R6.1
  Bottom 0.3: v56.06,46.46 56.06,45.5 56.07,45.5 56.07,43.1 v54.91,41.94
ADC_BAT_4  (via drill 0.5)
  Top 0.3: v51.06,46.51 51.06,48.3 R11.2 | U1.26 35.13,45.82 36.15,44.8 39.67,44.8 42.23,42.24 49.62,42.24 50,42.61 v50.43,42.61
  Top 0.5: R11.2 R8.1
  Bottom 0.3: v50.43,42.61 50.43,43.45 51.1,44.12 51.1,45.5 51.06,45.53 v51.06,46.51
ADC_BAT_5
  Top 0.3: R12.2 45.17,47.44 45.17,45.68 45.18,45.67 44.65,45.14 42.48,45.14 41.01,46.61 32.65,46.61 U1.27
  Top 0.5: R9.1 R12.2
ADC_BAT_6
  Top 0.3: R13.2 39.69,49.52 37.6,47.43 U1.28
  Top 0.5: R10.1 R13.2
BATTERY+  (via drill 0.5)
  Top 0.5: R29.2 42.21,29.76 46.44,29.76 | 46.44,30.87 U$19.2 46.44,29.76 | 46.44,29.76 52.54,29.76 v53.19,29.11 | v61.56,24.51 U$6.2 | v8.67,19.59 14.43,25.35 v21.42,25.35
  Bottom 0.5: v61.56,24.51 56.96,29.11 v53.19,29.11 49.43,25.35 v21.42,25.35 | C14.2 7.22,14.45 7.22,18.55 8.26,19.59 v8.67,19.59
  Bottom 0.7: U$1.2 11.44,15.24 10.7,14.5 8.37,14.5 C14.2
  pour Top (no thermals): 63,11.8 63,14.6 64.8,16.4 64.9,16.5 64.9,23.5 68.4,23.5 68.4,17.9 67.7,17.2 67.7,11.8
  pour Top (no thermals): 64.9,18.4 64.9,24.3 63.9,25.3 61.3,25.3 61.3,28 69.7,28 69.7,24.4 71.6,24.4 72.3,25.1 72.3,28.1 79.2,28.1 79.2,24.5 74.2,24.5 68.1,18.4
C1_B  (via drill 0.5)
  Top 0.3: v36.74,49.13 35.77,49.13 35.46,48.82 34.71,48.82 34.5,49.04 32.64,49.04 U1.30
  Bottom 0.3: R56.1 64.4,37.07 41.01,37.07 37.43,40.65 37.43,48.44 v36.74,49.13
C2_B  (via drill 0.5)
  Top 0.3: U1.31 33.89,49.84 33.99,49.74 35.08,49.74 v35.09,49.73
  Bottom 0.3: R55.1 59.97,37.67 41.25,37.67 38.03,40.89 38.03,49.32 37.32,50.03 35.39,50.03 v35.09,49.73
C3_B  (via drill 0.5)
  Top 0.3: v34.36,50.64 32.64,50.64 U1.32
  Bottom 0.3: R54.1 55.52,38.27 41.5,38.27 38.63,41.14 38.63,50.24 38.24,50.63 v34.37,50.63 v34.36,50.64
C4_B  (via drill 0.5)
  Top 0.3: v31.42,53.2 31.3,53.08 U1.1
  Bottom 0.3: R53.1 51.15,38.87 41.75,38.87 41.07,39.55 40.99,39.64 39.23,41.4 39.23,51.5 37.3,53.44 31.66,53.44 v31.42,53.2
C5_B  (via drill 0.5)
  Top 0.3: v31.22,54.36 31.22,54.27 30.52,53.57 U1.2
  Bottom 0.3: 41.67,39.8 | 41.67,39.8 42,39.47 46.79,39.47 R52.1 | 41.67,39.8 39.83,41.64 39.83,51.75 37.48,54.1 31.48,54.1 v31.22,54.36
C6_B  (via drill 0.5)
  Top 0.3: U1.9 24.39,53.91 25.3,54.82 25.3,55.71 26.13,56.53 29.67,56.53 v30.45,56.53
  Bottom 0.3: v30.45,56.53 31.63,56.53 33.46,54.7 37.74,54.7 40.4,52.04 40.4,52.03 40.43,52 40.43,41.89 41.88,40.44 42.72,40.44 R51.1
CELL1  (via drill 0.5)
  Top 0.3: R38.2 64.85,51.86 64.84,51.87 v64.67,51.87
  Top 0.5: R76.1 62.25,58.66 R77.1 63.65,58.64 v63.76,58.53
  Bottom 0.3: v64.67,51.87 64.71,51.91 66.16,51.91
  Bottom 0.5: v63.76,58.53 66.17,58.53 66.21,58.57 66.21,57.29 CELL1.1 66.5,55.06 66.16,55.06 66.16,51.91 66.16,51.2 U$15.2 66.55,51.2 R28.2
CELL2  (via drill 0.5)
  Top 0.3: R4.2 60.51,51.78 59.83,51.78 59.81,51.76 v59.61,51.76
  Top 0.5: R81.1 R80.1 58.62,58.64 v58.73,58.53
  Bottom 0.3: v59.61,51.76 59.66,51.81 61.17,51.81
  Bottom 0.5: v58.73,58.53 61.59,58.53 61.66,58.6 61.66,57.16 CELL2.1 61.5,55.9 61.17,55.9 61.17,51.81 61.17,51.2 U$16.2 61.55,51.2 R40.2
CELL3  (via drill 0.5)
  Top 0.3: R6.2 55.38,51.12 v54.76,51.74
  Top 0.5: R83.1 R82.1 53.72,58.65 53.72,58.56 arc90 v53.75,58.53
  Bottom 0.3: v54.76,51.74 55.3,51.2 U$17.2
  Bottom 0.5: v53.75,58.53 56.3,58.53 56.57,58.26 56.57,57.07 CELL3.1 56.5,55.8 56.19,55.8 56.19,51.2 U$17.2 56.56,51.2 R41.2
CELL4  (via drill 0.5)
  Top 0.3: R8.2 50.02,51.69 v49.68,51.69
  Top 0.5: R85.1 R84.1 48.58,58.63 48.68,58.53 v48.77,58.53
  Bottom 0.3: v49.68,51.69 50.17,51.2 U$18.2
  Bottom 0.5: v48.77,58.53 50.74,58.53 arc-90 51.41,57.86 51.41,57.09 arc90 CELL4.1 51.5,54.78 51.23,54.51 51.23,51.2 U$18.2 51.56,51.2 R42.2
CELL5  (via drill 0.5)
  Top 0.3: R9.2 44.84,51.78 v44.84,51.8
  Top 0.5: R87.1 R86.1 arc-90 42.28,58.65 43.8,58.65 arc90 43.73,58.58 v43.73,58.53
  Bottom 0.3: v44.84,51.8 44.91,51.87 46.22,51.87
  Bottom 0.5: v43.73,58.53 45.41,58.53 45.87,58.07 45.87,57.63 CELL5.1 46.5,55.47 46.22,55.47 46.22,51.87 46.22,51.2 U$20.2 46.56,51.2 R43.2
CELL6  (via drill 0.5)
  Top 0.3: R10.2 42.13,52.7 v41.02,52.7
  Bottom 0.3: v41.02,52.7 41.12,52.81 41.2,52.81
  Bottom 0.5: CELL6.1 41.5,54.75 41.2,54.75 41.2,52.81 41.2,51.2 U$21.2 41.56,51.2 R44.2
CHARGE_CONTROL
  Top 0.5: R89.1 27.06,25.12 27.06,17.22 28.72,15.56 31.12,15.56 U$2.1
CHARGE_PWM
  Top 0.3: U$37.2 23.68,34.77 23.3,35.15 20.48,35.15 20.2,35.42 20.2,47.5 22.09,49.39 22.09,49.4 22.62,49.93 23.37,49.93 23.46,49.84 U1.10
CURRENT+
  Top 0.3: R21.2 57.31,23.71 57.22,23.62
  pour Top (no thermals): 63.64,23.65 63.64,22.21 60.64,22.21 58.96,20.53 58.94,20.53 58.94,16.08 57.07,16.08 57.07,23.58 57.14,23.65
CURRENT-  (via drill 0.5)
  Top 0.3: R22.2 56.33,27.05 v56.33,27.04 | v59.94,18.87 61.51,17.3 U$4.2
  Top 1.2: C5.+ 61.33,7.31 61.33,9.55 | 61.33,9.55 U$5.L | C7.1 61.33,9.55
  Bottom 0.3: v56.33,27.04 59.94,23.42 v59.94,18.87
  pour Top (no thermals): 61.83,11.93 61.83,15.36 63.05,16.58 63.67,16.58 63.67,18.02 60.7,18.02 60.7,11.98 60.7,11.93
CURRENTSENSE  (via drill 0.5)
  Top 0.3: R24.1 53.04,33.38 U$38.1 52.95,33.91 52.23,34.64 R23.1 50.85,34.62 48.96,34.62 C3.1 v47.8,34.64 | U1.19 27.21,43.61 27.21,42.79 27.1,42.69 v27.1,42.32
  Bottom 0.3: v27.1,42.32 34.91,42.32 40.76,36.47 45.97,36.47 v47.8,34.64
EN_15V  (via drill 0.5)
  Top 0.3: R75.1 13.45,36.91 13.45,32.71 5.04,24.3 5.04,15.68 7.02,13.69 14.51,13.69 v15.4,14.58
  Bottom 0.3: U$1.7 17.36,16.38 17.36,15.31 16.63,14.58 v15.4,14.58
EN_LED
  Top 0.3: R74.1 U$36.4
FEEDBACK
  Bottom 0.7: U$1.6 R59.1 R60.2
GND  (via drill 0.5)
  Top 0.3: U1.3 29.62,51.86 29.62,50.52 28.92,49.82 U1.21 28.92,41.42 28.87,41.38 28.87,40.24 C13.1 v27.86,37.76 v27.85,37.76 | U1.5 28.1,54.11 v27.8,54.41 | C2.2 28.2,6.71 C4.- | v27.23,26.99 27.75,26.99 U$3.R U$3.L | v13.37,14.6 10.13,14.6 U$32.R | U$10.2 63.48,44.24 v63.48,46.53 63.48,52.93 68.22,52.93 68.22,51.8 69.08,51.8 | 69.08,51.8 68.47,51.19 68.47,44.49 U$9.2 67.98,46.41 v68.42,46.85 | 69.08,51.8 69.69,52.41 70.98,52.41 v72.38,53.81
  Top 0.5: R78.1 R79.1 | 74.74,58.65 GND.P$1 74.74,55.83 v74.27,55.83 | v46.07,46.27 46.07,45.25 44.81,43.99 U$14.2 | v48.65,47.56 48.65,47.34 48.83,47.16 48.83,45.3 48.73,45.2 U$13.2 | v53.63,46.96 53.63,44.4 U$12.2 | U$11.2 58.48,44.26 v58.48,46.56 58.48,48.77 v60.14,50.44 | BATTERY-.P$1 74.34,4.68 v73.56,4.68
  Top 0.8: U$32.L U$32.R arc90 8.68,16.05 v5.94,16.05
  Bottom 0.3: v27.8,54.41 27.8,54.77 27.84,54.82 27.84,55.82 27.13,56.53 26.13,56.53 24.92,55.32 SV1.1 arc-90 24.06,55.29 v21.35,55.29 | R60.1 17.16,22.8 14.78,22.8 13.5,21.52 R58.1 | U$33.1 15.89,25.85 15.65,26.09 13.59,26.09 v13.28,26.4 | v60.14,50.44 60.14,50.33 60.56,49.92 60.56,48.3 61.97,46.89 61.97,46.57 U$30.2 v63.48,46.53 61.97,46.34 | v68.42,46.85 68.42,46.47 U$24.2 | v27.85,37.76 27.85,37.49 v33.31,37.49
  Bottom 0.5: U$31.2 42.73,47.74 v43.52,47.74 | v46.07,46.27 47.24,46.27 U$28.2 47.75,46.66 v48.65,47.56 | U$29.2 52.72,46.05 v53.63,46.96 | U$27.2 v58.48,46.56
  Bottom 0.8: v33.31,37.49 arc-90 33.43,37.61 v36.43,37.61
  other vias: 73.48,6.8 76.42,6.75 78.54,6.76 73.68,2.49 76.48,2.49 78.67,2.43 76.36,4.72 78.53,4.64 72.41,57.81 74.26,57.89 76.02,57.87 77.93,57.91 77.94,55.79 78.02,53.83 75.98,53.82 74.22,53.77 72.42,55.81 76.11,55.88 48.69,31.62 57.92,35.81 18.27,29.26 2.97,16.21 2.84,13.12 2.99,9.62
  pour Bottom: 71.36,61.29 81.12,61.29 81.12,-0.47 71.33,-0.47 71.33,61.29
  pour Top (rank 2): 68.64,61.62 68.64,29.84 68.64,9.35 70.68,7.31 70.68,0.87 61.83,0.87 arc-90 60.48,2.22 60.48,23.18 60.48,23.26 53.53,30.21 27.66,30.21 26.75,29.3 26.75,25.1 -1.63,25.1 -1.68,25.15 -1.68,60.61 -0.64,61.65
  pour Top (rank 2): 38.63,59.13 38.63,41.09 38.68,41.04 69.09,41.04 68.55,59.81 38.63,59.86 38.53,59.76 38.53,59.23
  pour Bottom (rank 2): -0.8,62.15 68.13,62.15 68.31,62.33 69.41,61.23 69.41,29.65 69.4,29.9 69.53,-0.26 62.35,2.18 62.35,24.7 1.31,24.68 -0.8,26.79
  pour Bottom: 67.41,7.35 67.71,7.05 67.71,-1.31 -1.61,-1.31 -1.61,23.08 15.16,23.08 15.16,12.01 33.65,12.01 33.65,7.5
  pour Top: 4.08,26.16 4.08,25.68 5,25.68 5,13.35 12.61,13.35 12.61,1.12 -1.21,1.12 -0.89,26.79
MISO  (via drill 0.5)
  Top 0.3: v18.87,51.33 R74.2 | 24.39,44.94 U1.16 23.97,45.04 23.5,44.57 v22.91,44.57
  Bottom 0.3: v22.91,44.57 20.97,44.57 18.87,46.67 v18.87,51.33 18.87,54.51 21.01,56.65 24.59,56.65 25.42,57.47 25.42,58.36 26.13,59.07 27.13,59.07 28.34,57.86 SV1.6
MOSI  (via drill 0.5)
  Top 0.3: 24.29,45.93 U1.15 23.08,45.82 v22.99,45.73 | R75.2 v13.51,42.06
  Bottom 0.3: SV1.3 26.2,55.32 24.79,53.91 22.94,53.91 19.61,50.58 19.61,47.06 20.94,45.73 v22.99,45.73 23.25,45.48 23.28,45.48 23.81,44.95 23.81,44.2 23.28,43.67 15.12,43.67 v13.51,42.06
MOTOR+
  pour Top (no thermals): 59.32,32.39 80.01,32.39 80.01,45.5 69.28,45.5 69.28,41.15 59.32,41.15
MOTOR_CONTROL  (via drill 0.5)
  Top 0.5: R1.2 71.28,25.92 U$22.1 71.19,26.78 71.19,28.44 70.93,28.7 60.92,28.7 60.58,28.36 | U$6.1 60.28,28.06 60.58,28.36 | v59.74,29.28 60.58,28.45 60.58,28.36
  Bottom 0.5: U$26.3 58.73,30.29 v59.74,29.28
N$1
  Bottom 0.7: U$1.3 12.71,18.75 C1.2
N$2
  Top 0.5: U$7.2 26.66,29.97 C12.1 22.94,29.95 22.41,29.42 U$37.6
N$3
  Top 0.5: R13.1 42.26,47.2 U$14.3
N$4
  Top 0.5: R12.1 47.26,46.75 U$13.3
N$5  (via drill 0.5)
  Top 0.5: R2.2 R14.2 67.31,53.87 v68.53,53.87
  Bottom 0.5: v68.53,53.87 68.06,53.4 U$15.3
N$6  (via drill 0.5)
  Top 0.5: R31.2 R15.2 v63.46,53.9
  Bottom 0.5: v63.46,53.9 62.96,53.4 U$16.3
N$7
  Top 0.5: R11.1 U$12.3
N$8
  Top 0.5: R7.1 U$11.3
N$9
  Top 0.5: R5.1 U$10.3
N$10
  Top 0.3: 67.27,46.44 U$9.3
  Top 0.5: R3.1 67.27,46.44
N$11  (via drill 0.5)
  Top 0.5: R32.1 R16.1 v58.52,53.92
  Bottom 0.5: v58.52,53.92 58,53.4 U$17.3
N$12  (via drill 0.5)
  Top 0.5: R33.1 R17.1 v53.41,53.91
  Bottom 0.5: v53.41,53.91 52.9,53.4 U$18.3
N$13  (via drill 0.5)
  Top 0.5: R34.1 R18.1 47.29,53.88 v48.45,53.88
  Bottom 0.5: v48.45,53.88 47.97,53.4 U$20.3
N$14  (via drill 0.5)
  Top 0.5: R35.1 R19.1 v43.57,53.91 | 43.64,53.91 v43.57,53.91 | v43.57,53.91 v43.56,53.92
  Bottom 0.5: v43.56,53.92 43.04,53.4 U$21.3
N$15
  Top 0.3: R21.1 57.31,30.65 55.49,32.47 U$38.3 55.47,33.49 55.47,34.93 54.06,36.34 R23.2
N$16
  Top 0.3: R22.1 55.28,30.95 R24.2 54.23,32.01 U$38.2
N$17
  Top 0.3: 24.39,48.23 U1.12 21.95,48.24 20.8,47.09 20.8,40.61 LED2.C 20.98,40.61
N$18
  Top 0.3: LED1.C 21.61,38.69 21.61,39.11 21.76,39.26 22.44,39.26 22.7,39.52 22.7,41.7 21.4,43 21.4,46.84 21.98,47.42 U1.13
N$19
  Top 0.3: 24.31,46.72 U1.14 22.28,46.64 22,46.36 22,43.25 23.3,41.95 23.3,38.04 22.45,37.19 21.3,37.19 21.3,36.66 LED3.C
N$20
  Top 0.5: U$19.1 44.19,31.5 40.84,31.5 39.87,30.53 R29.1 37.43,30.4 PAD1.1 35.09,30.93 U$25.3
N$21
  Bottom 0.7: U$1.1 10.17,18.81 C1.1 10.56,22.24 10.5,22.3 7.43,22.3 U$35.P$1 7.3,23.4 11.9,23.4 13.4,24.9 U$33.3
N$22
  Bottom 0.5: U$15.1 R28.1 R45.2
N$23
  Top 0.5: R27.1 16.94,40.61 LED2.A
N$24
  Top 0.5: R26.1 LED1.A
N$25
  Top 0.5: R25.1 LED3.A
N$26
  Bottom 0.5: R39.1 U$26.2
N$27
  Top 0.3: U1.22 29.7,40.76 R37.2 29.82,39.29 R36.1
N$28
  Bottom 0.5: U$16.1 R40.1 R46.2
N$29
  Bottom 0.5: U$17.1 R41.1 R47.2
N$30
  Bottom 0.5: U$18.1 R42.1 R48.2 54.92,49.21
N$31
  Bottom 0.5: U$20.1 R43.1 R49.2
N$32
  Bottom 0.5: R50.2 R44.1 43.26,51.2 U$21.1
N$33
  Bottom 0.5: R49.1 49.91,44.81 U$28.3
N$34
  Bottom 0.3: 44.93,47.47 R50.1
  Bottom 0.5: U$31.3 44.93,47.47
N$35
  Bottom 0.5: R48.1 54.89,44.81 U$29.3
N$36
  Bottom 0.3: R47.1 59.56,45.13 U$27.3
N$37
  Bottom 0.3: U$30.3 64.89,44.9
  Bottom 0.5: R46.1 64.53,44.85 U$30.3
N$38
  Bottom 0.5: R45.1 U$24.3
N$39
  Bottom 0.3: U$31.1
  Bottom 0.5: R51.2 U$31.1
N$40
  Bottom 0.3: 47.75,42.13 R52.2
  Bottom 0.5: U$28.1 47.75,42.13
N$41
  Bottom 0.3: 52.7,43.84 U$29.1
  Bottom 0.5: R53.2 52.7,43.84
N$42
  Bottom 0.5: R54.2 U$27.1
N$43
  Bottom 0.3: U$30.1
  Bottom 0.5: R55.2 U$30.1
N$44
  Bottom 0.3: 67.73,42.14 R56.2
  Bottom 0.5: 67.73,42.14 U$24.1
N$45
  Bottom 0.5: R57.2 20.1,14.9 16.8,11.6 16.8,11.28 U$1.8
N$46
  Bottom 0.7: U$1.5 15.25,21.21 R58.2
N$47
  Top 0.5: R63.2 R61.2 7.63,56.89 EXT_LED1.1
N$48
  Top 0.5: R61.1 R62.2
N$49
  Top 0.5: R63.1 R64.2
N$50
  Top 0.5: EXT_LED2.1 11.73,56.84 R65.2 R66.2
N$51
  Top 0.5: R65.1 R67.2
N$52
  Top 0.5: R66.1 R68.2
N$53
  Top 0.5: R64.1 R62.1 R68.1 R67.1 R72.1 | R72.1 R71.1 | R72.1 13.77,46.98 U$36.5 U$36.6 U$36.7 U$36.8
N$54
  Top 0.5: EXT_LED3.1 13.77,56.85 R70.2 R69.2
N$55
  Top 0.5: R69.1 R71.2
N$56
  Top 0.5: R70.1 R72.2
N$58
  Top 0.5: R77.2 R15.1
N$59
  Top 0.5: R76.2 R31.1
N$60
  Top 0.5: R78.2 R2.1
N$61
  Top 0.5: R79.2 R14.1
N$62
  Top 0.5: R80.2 R16.2
N$63
  Top 0.5: R81.2 R32.2
N$64
  Top 0.5: R82.2 R17.2
N$65
  Top 0.5: R33.2 R83.2
N$66
  Top 0.5: R84.2 R18.2
N$67
  Top 0.5: R85.2 R34.2
N$68
  Top 0.5: R19.2 R86.2
N$69
  Top 0.5: R87.2 R35.2
N$70
  Top 0.5: R88.1 26.7,33.91 U$7.1
N$71
  Top 0.5: U$37.7 23.68,26.8 R89.2
N$73
  pour Top (rank 2, no thermals): 74.4,23.4 74.4,18.1 72.3,16 79.2,16 79.5,16 79.5,16.5 77.9,18.1 77.9,23.4
RESETICSP
  Top 0.3: U1.29 34.45,48.24 34.47,48.22 37.11,48.22 37.14,48.25 37.22,48.25 37.87,48.9 37.87,52.42 34.86,55.43 R20.1 33.9,56.97 31.8,59.07 25.3,59.07 SV1.2
SCK  (via drill 0.5)
  Top 0.3: SV1.4 25.9,57.13 25.88,57.13 25.28,56.53 23.59,56.53 22.88,55.82 22.88,53.56 v23.49,52.95 | U1.17 25.72,42.94 v25.54,42.77
  Bottom 0.3: v25.54,42.77 25.54,44.52 25.13,44.93 25.13,51.31 v23.49,52.95
SELBSTERHALTUNG  (via drill 0.5)
  Top 0.3: U1.8 25.73,51.96 v25.73,53.42 | R30.2 34.84,38.98 34.52,39.31 34.52,40.11 v36.51,42.1
  Top 0.5: R30.2 32.4,32.82 U$25.1
  Bottom 0.3: v36.51,42.1 35.98,42.1 35.15,42.92 27.99,42.92 25.73,45.18 v25.73,53.42
TEST
  Top 0.5: 44.54,34.3 C9.1 | 44.54,34.3 U$19.3 | U$8.8 43.39,32.91 44.54,34.06 44.54,34.3
TS
  Top 0.5: U$37.8 26.62,28.23 C12.2 26.93,28.25 27.79,29.11 29.65,29.11 31.81,26.95 U$3.PAD
  pour Top (no thermals): 30.46,28.44 30.46,23.37 29.81,23.37 29.81,16.61 34.4,16.61 34.4,15.75 36.91,15.75 36.91,19.58 33.41,19.58 33.41,23.44 33.41,25.46 34.95,25.46 34.95,28.44
UC_M_CONT  (via drill 0.5)
  Top 0.3: v23,49.02 U1.11 24.31,48.94 | v23,49.02
  Bottom 0.3: U$26.1 47.77,33.35 45.41,35.71 40.67,35.71 34.96,41.42 25.61,41.42 24.43,42.6 24.43,48.44 23.85,49.02 v23,49.02
V_MEAS  (via drill 0.5)
  Top 0.3: U1.7 26.61,52.05 26.61,52.87 26.88,53.13 26.92,53.13 v27.18,53.39 | 42.32,43.63 U$14.1 | U$14.1 42.38,43.99 43.53,42.84 46.65,42.84 46.69,42.88 | U$9.1 64.91,42.83 61.25,42.83 61.25,43.91 U$10.1 61.3,43.96 60.05,43.96 58.92,42.83 56.34,42.83 56.34,43.98 U$11.1 55.07,44 53.91,42.84 51.34,42.84 51.33,42.83 U$12.1 50.53,43.99 49.42,42.88 46.69,42.88 | 46.64,43.84 U$13.1 46.69,43.89 46.69,42.88 | U$14.1 40.6,45.71 v36.53,45.71
  Bottom 0.3: v36.53,45.71 34.86,45.71 v27.18,53.39
VCC  (via drill 0.5)
  Top 0.3: U$2.8 22.67,20.99 v22.67,26.77 | v30.17,35.22 v30.18,35.23 R36.2
  Top 1: VIN.P$1 19.2,12.51 C2.1 27.98,12.51 C4.+
  Bottom 0.3: v22.67,26.77 30.17,34.27 v30.17,35.22
  pour Top (no thermals): 22.5,2.09 22.5,13.02 22.5,14.51 25.38,14.51 25.38,24.19 16.67,24.19 16.67,12.98 15.84,12.98 15.84,2.09
  pour Top (rank 2, no thermals): 10.4,18.5 10.4,15.4 17.2,15.4 17.2,18.5